# Altium project HV_Module_6W.PrjPCB (part 3 of 3)

## Sheet Supply_12V_ISOL.SchDoc: HV_Module
size 420 x 297 mm; EDA_Number: ARTIQ; Projet: HV_Module; Author: G.Kasprowicz; CompanyName: WUT ISE; DrawnBy: G.Kasprowicz; Organization: WUT ISE; Address1: PW ISE; Address2: Nowowiejska 15/19 00-665 Warsaw; Address3: gkasprow@gmail.com; DocumentNumber: 6; Revision: 1.0; SheetNumber: 6; SheetTotal: 6; ModifiedBy: -; CheckedDate: -; Title2: Supply_5V_ISOL; DivGrp: WUT ISE; Designer: G.Kasprowicz; ModifiedDate: -; ProjectName: Sensor Box
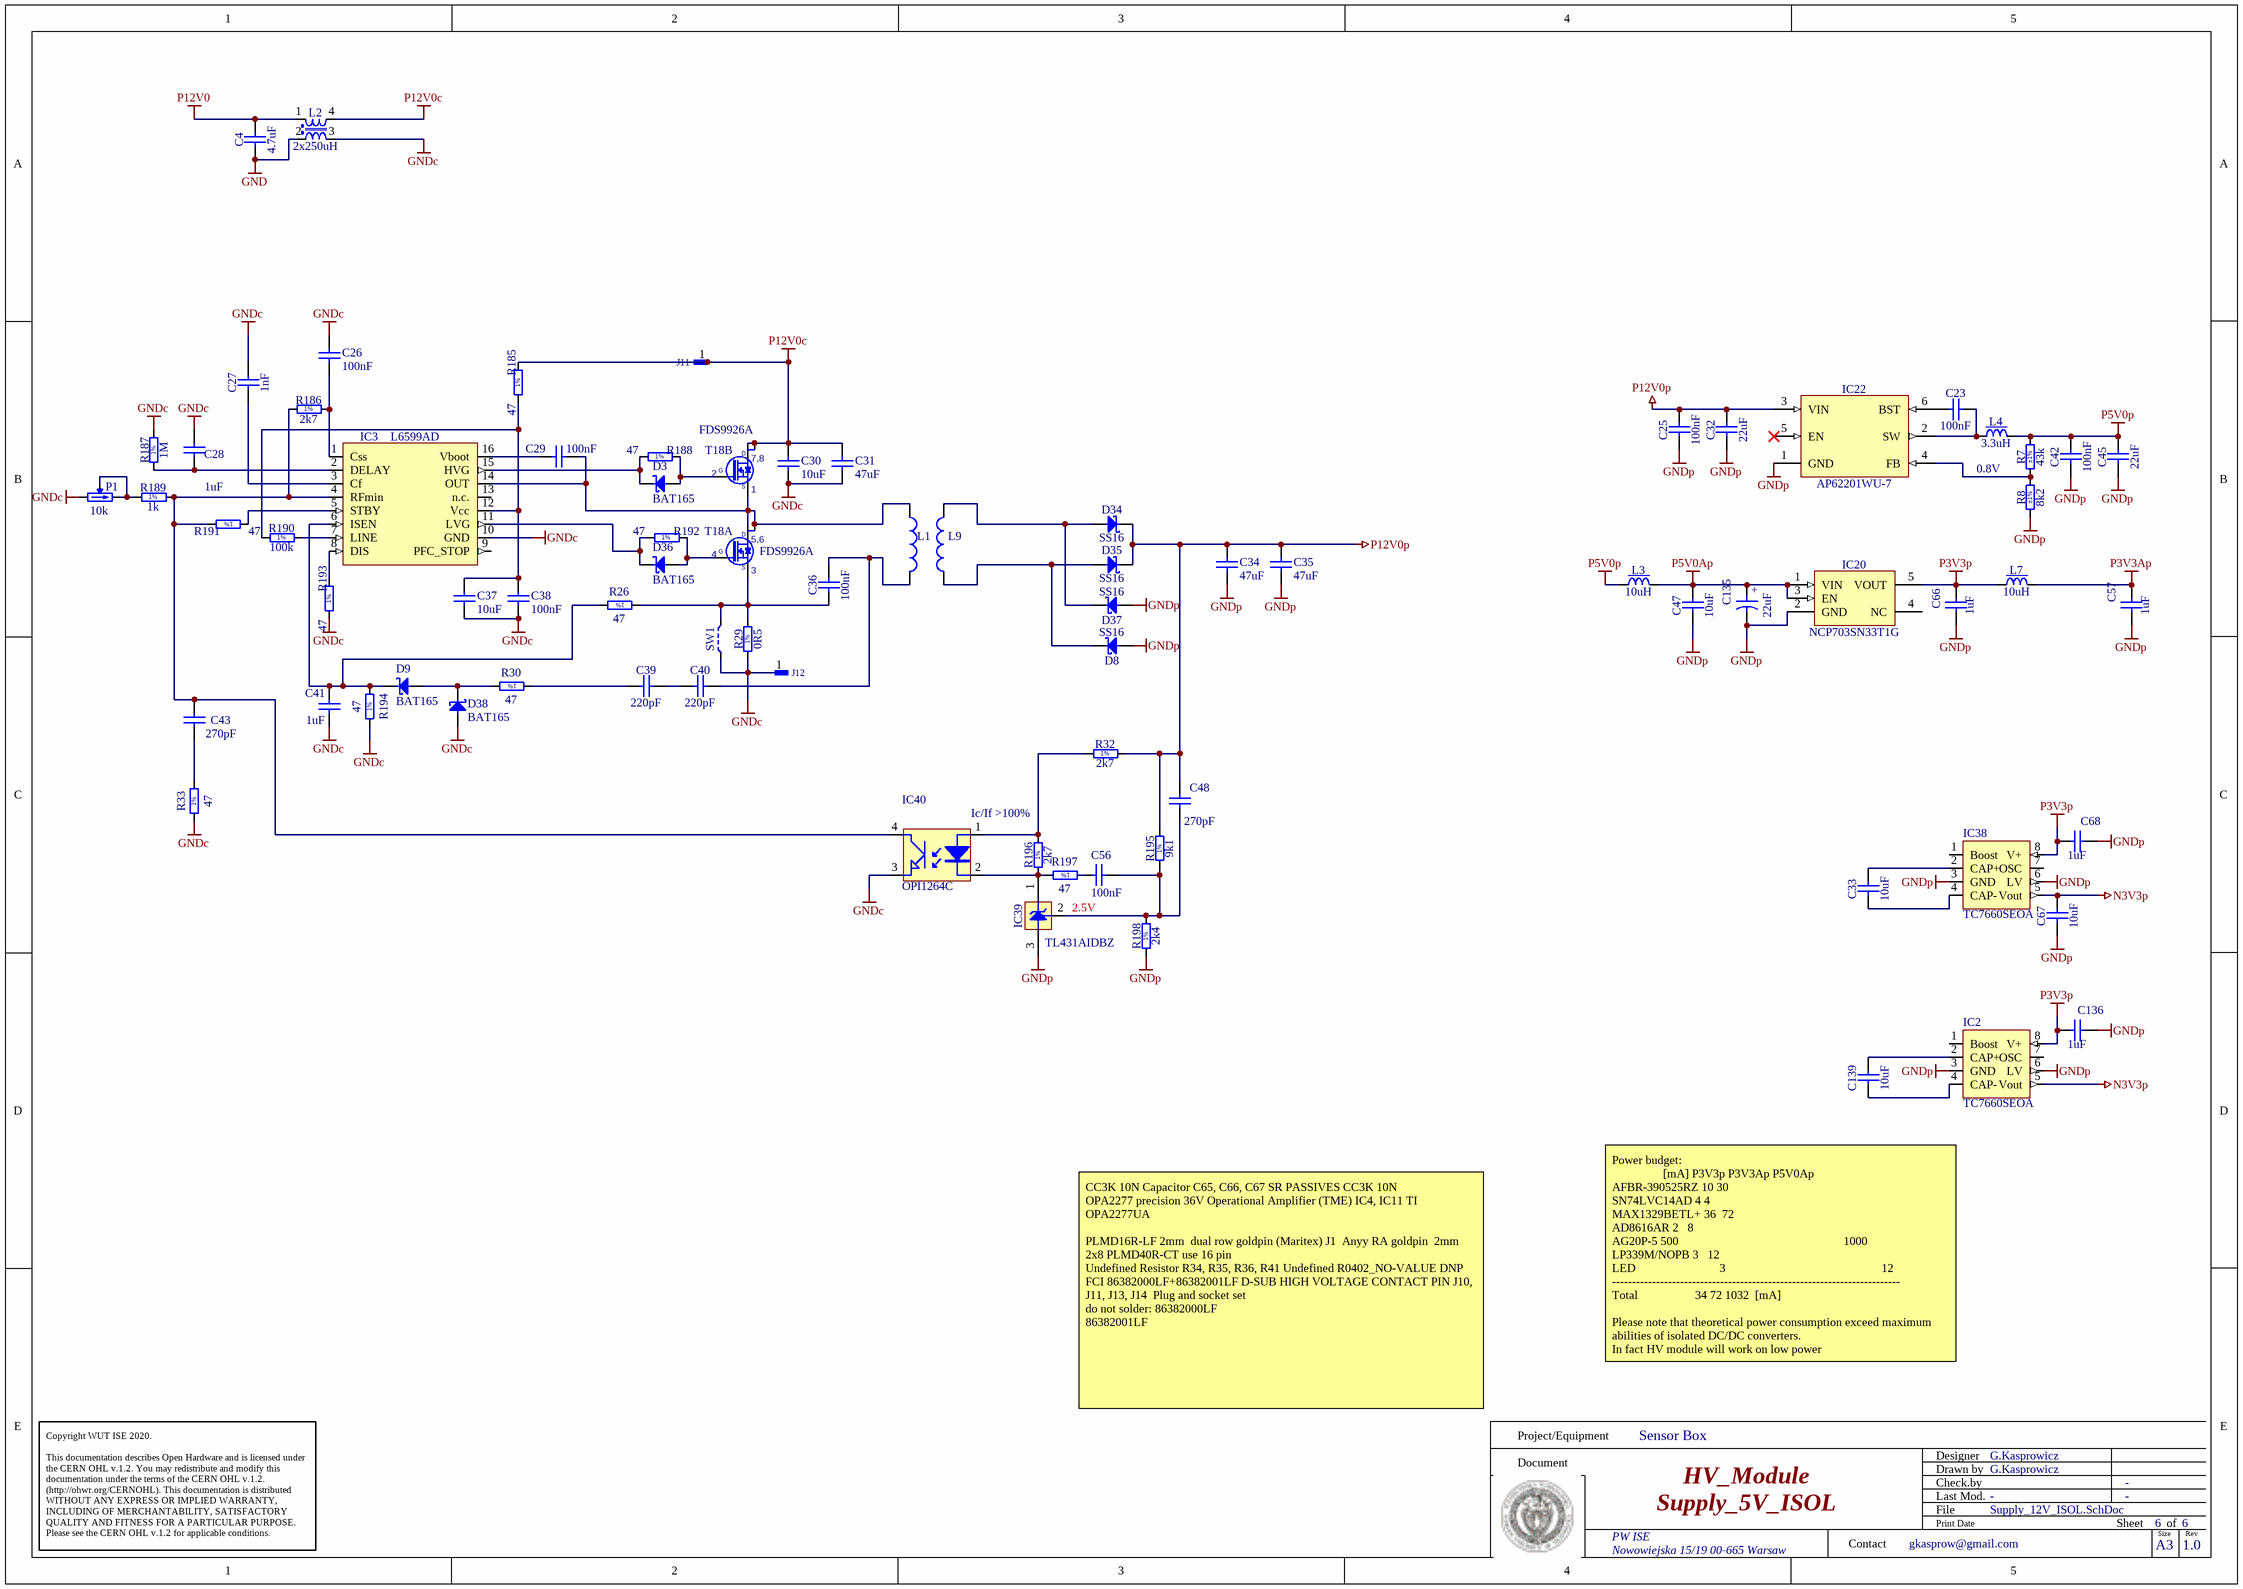
[diagram p4: Supply_12V_ISOL.SchDoc]

### Parts
C4  4.7uF  [CAPC2012X145N]
C23  100nF  [CAPC1005X55N]
C25  100nF  [CAPC1005X55N]
C26  100nF  [CAPC1005X55N]
C27  1nF  [CAPC1608X90N]
C28  1uF  [CAPC1608X87N]
C29  100nF  [CAPC1005X55N]
C30  10uF  [CAPC3216X180N]
C31  47uF  [CAPC3216X180N]
C32  22uF  [CAPC2012X135N]
C33  10uF  [CAPC1608X80N]
C34  47uF  [CAPC3216X180N]
C35  47uF  [CAPC3216X180N]
C36  100nF  [CAPC4532X250N]
C37  10uF  [CAPC3216X180N]
C38  100nF  [CAPC1005X55N]
C39  220pF  [CAPC3225X200N]
C40  220pF  [CAPC3225X200N]
C41  1uF  [CAPC1608X87N]
C42  100nF  [CAPC1005X55N]
C43  270pF  [CAPC1608X87N]
C45  22uF  [CAPC2012X135N]
C47  10uF  [CAPC1608X80N]
C48  270pF  [CAPC1608X87N]
C56  100nF  [CAPC1005X55N]
C57  1uF  [CAPC1005X55N]
C66  1uF  [CAPC1005X55N]
C67  10uF  [CAPC1608X80N]
C68  1uF  [CAPC1005X55N]
C135  22uF  [CAPMP3528X210N]
C136  1uF  [CAPC1005X55N]
C139  10uF  [CAPC1608X80N]
D3  BAT165  [SOD2512X110N]
D8  SS16  [DIOM5127X229N]
D9  BAT165  [SOD2512X110N]
D34  SS16  [DIOM5127X229N]
D35  SS16  [DIOM5127X229N]
D36  BAT165  [SOD2512X110N]
D37  SS16  [DIOM5127X229N]
D38  BAT165  [SOD2512X110N]
IC2  TC7660SEOA  [SO-8]
IC3  L6599AD  [SOIC127P600X175-16N]
IC20  NCP703SN33T1G  [SOT95P275X110-5N]
IC22  AP62201WU-7  [SOT95P280X100-6N]
IC38  TC7660SEOA  [SO-8]
IC39  TL431AIDBZ  [SOT95P237X112-3N]
IC40  OPI1264C  [OPI1264C]
J11  SMD Pad  [R400X300]  (value not drawn)  (no BOM)
J12  SMD Pad  [R400X300]  (value not drawn)  (no BOM)
L1  6.8uH  [760308101104]  (value not drawn)
L2  2x250uH  [IND_WURTH_WE-SL2]
L3  10uH  [IND_BOURNS_PM43]
L4  3.3uH  [IND_WURTH_WE-TPC_4828]
L7  10uH  [IND_BOURNS_PM43]
L9  6.8uH  [760308101104]  (value not drawn)
P1  10k  [TRIM_BOURNS_3314G-1]
R7  43k  Tolerance: ±1%  [RESC1005X40N]
R8  8k2  Tolerance: ±1%  [RESC1005X40N]
R26  47  [RESC1608X55N]
R29  0R5  [RESC6532X80N]
R30  47  [RESC1608X55N]
R32  2k7  [RESC1608X55N]
R33  47  [RESC1608X55N]
R185  47  [RESC1608X55N]
R186  2k7  [RESC1608X55N]
R187  1M  [RESC1608X55N]
R188  47  [RESC1608X55N]
R189  1k  [RESC1005X40N]
R190  100k  [RESC1005X40N]
R191  47  [RESC1608X55N]
R192  47  [RESC1608X55N]
R193  47  [RESC1608X55N]
R194  47  [RESC1608X55N]
R195  9k1  [RESC1608X55N]
R196  2k7  [RESC1608X55N]
R197  47  [RESC1608X55N]
R198  2k4  [RESC1608X55N]
SW1  Switch  [JUMPSMD0805_G50]  (value not drawn)  (no BOM)
T18  FDS9926A  [SOIC127P600X175-8N]  (parts A,B of 2)

### Nets
GND: C4.1 L2.2
GNDc: C26.1 C27.2 C28.2 C30.2 C31.2 C37.2 C38.2 C41.1 D38.2(A) IC3.10(GND) IC40.3(E) J12.1 L2.3 P1.1(CCW) R29.1 R33.1 R187.2 R193.1 R194.1 SW1.1
GNDp: C25.1 C32.1 C34.2 C35.2 C42.1 C45.1 C47.1 C57.1 C66.1 C67.1 C68.2 C135.2 C136.2 D8.2(A) D37.2(A) IC2.3(GND) IC2.6(LV) IC20.2(GND) IC22.1(GND) IC38.3(GND) IC38.6(LV) IC39.3(A) R8.1 R198.1
N3V3p: C67.2 IC2.5(Vout) IC38.5(Vout)
P3V3Ap: C57.2 L7.2
P3V3p: C66.2 C68.1 C136.1 IC2.8(V+) IC20.5(VOUT) IC38.8(V+) L7.1
P5V0Ap: C47.2 C135.1 IC20.1(VIN) IC20.3(EN) L3.2
P5V0p: C42.2 C45.2 L3.1 L4.2 R7.2
P12V0: C4.2 L2.1
P12V0c: C30.1 C31.1 J11.1 L2.4 R185.2 T18.7(D) T18.8(D)
P12V0p: C25.2 C32.2 C34.1 C35.1 C48.2 D34.1(C) D35.1(C) IC22.3(VIN) R32.2 R195.2
NetC23_1: C23.1 IC22.6(BST)
NetC23_2: C23.2 IC22.2(SW) L4.1
NetC26_2: C26.2 IC3.1(Css) R186.2
NetC27_1: C27.1 IC3.3(Cf)
NetC28_1: C28.1 IC3.2(DELAY) R187.1
NetC29_1: C29.1 IC3.16(Vboot)
NetC29_2: C29.2 IC3.14(OUT) L1.1 T18.1(S) T18.5(D) T18.6(D)
NetC33_1: C33.1 IC38.4(CAP-)
NetC33_2: C33.2 IC38.2(CAP+)
NetC36_1: C36.1 R26.1 R29.2 SW1.2 T18.3(S)
NetC36_2: C36.2 C40.2 L1.2
NetC37_1: C37.1 C38.1 IC3.12(Vcc) R185.1 R190.1
NetC39_1: C39.1 R30.1
NetC39_2: C39.2 C40.1
NetC41_2: C41.2 D9.1(C) IC3.6(ISEN) R26.2 R194.2
NetC43_1: C43.1 R33.2
NetC43_2: C43.2 IC3.4(RFmin) IC40.4(C) R186.1 R189.2 R191.2
NetC48_1: C48.1 C56.1 IC39.2(Adj) R195.1 R198.2
NetC56_2: C56.2 R197.1
NetC139_1: C139.1 IC2.4(CAP-)
NetC139_2: C139.2 IC2.2(CAP+)
NetD3_1: D3.1(C) IC3.15(HVG) R188.1
NetD3_2: D3.2(A) R188.2 T18.2(G)
NetD8_1: D8.1(C) D35.2(A) L9.1
NetD9_2: D9.2(A) D38.1(C) R30.2
NetD34_2: D34.2(A) D37.1(C) L9.2
NetD36_1: D36.1(C) IC3.11(LVG) R192.1
NetD36_2: D36.2(A) R192.2 T18.4(G)
NetIC3_5: IC3.5(STBY) R191.1
NetIC3_7: IC3.7(LINE) R190.2
NetIC3_8: IC3.8(DIS) R193.2
NetIC22_4: IC22.4(FB) R7.1 R8.2
NetIC39_1: IC39.1(C) IC40.2(K) R196.1 R197.2
NetIC40_1: IC40.1(A) R32.1 R196.2
NetP1_2: P1.2(W) P1.3(CW) R189.1

Not connected (* = marked no-connect by the designer): IC2 1(Boost) 7(OSC); IC3 9(PFC_STOP) 13(n.c.); IC20 4(NC); IC22 5(EN)*; IC38 1(Boost) 7(OSC)

### Notes on the sheet
- 0.8V
- 2.5V
- CC3K 10N	Capacitor	C65, C66, C67	SR PASSIVES	CC3K 10N
  OPA2277	precision 36V Operational Amplifier (TME)	IC4, IC11	TI	OPA2277UA
  PLMD16R-LF	2mm  dual row goldpin (Maritex)	J1		Anyy RA goldpin  2mm 2x8	PLMD40R-CT use 16 pin
  Undefined	Resistor	R34, R35, R36, R41	Undefined	R0402_NO-VALUE	DNP
  FCI 86382000LF+86382001LF	D-SUB HIGH VOLTAGE CONTACT PIN	J10, J11, J13, J14		Plug and socket set
  do not solder:	86382000LF
  86382001LF
- Power budget:
  [mA]	P3V3p	P3V3Ap	P5V0Ap
  AFBR-390525RZ	10	30
  SN74LVC14AD	4	4
  MAX1329BETL+	36		72
  AD8616AR	2			8
  AG20P-5	500	                		                                    1000
  LP339M/NOPB	3			12
  LED                            3                                                    12
  ------------------------------------------------------------------------
  Total		                 34	72	1032  [mA]
  Please note that theoretical power consumption exceed maximum abilities of isolated DC/DC converters.
  In fact HV module will work on low power
- Project/Equipment
- Document
- Designer
- Drawn by
- Check.by
- Copyright WUT ISE 2020.
  This documentation describes Open Hardware and is licensed under the CERN OHL v.1.2. You may redistribute and modify this documentation under the terms of the CERN OHL v.1.2. (http://ohwr.org/CERNOHL). This documentation is distributed WITHOUT ANY EXPRESS OR IMPLIED WARRANTY, INCLUDING OF MERCHANTABILITY, SATISFACTORY QUALITY AND FITNESS FOR A PARTICULAR PURPOSE. Please see the CERN OHL v.1.2 for applicable conditions.
- Contact
- File
- Last Mod.
- Print Date
- Sheet
- Size
- A3
- of
- Rev
- (in symbol CTE3528-21_22UF_20V_10%) +
- (in symbol FDS9926A, part A) 5,6
- (in symbol FDS9926A, part B) 7,8
- (in symbol OPTO-OPI1264C) Ic/If >100%
- (in symbol R0402_1K_1%_0.0625W_100PPM) 1%
- (in symbol R0402_100K_1%_0.0625W_100PPM) 1%
- (in symbol R0603_1M_1%_0.1W_100PPM) 1%
- (in symbol R0603_2K4_1%_0.1W_100PPM) 1%
- (in symbol R0603_2K7_1%_0.1W_100PPM) 1%
- (in symbol R0603_9K1_1%_0.1W_100PPM) 1%
- (in symbol R0603_47R_1%_0.1W_100PPM) 1%
- (in symbol R2512_0R5_1%_1.5W_100PPM) 1%

### Library data of the parts
C4 = CC0805_4.7UF_50V_10%_X7R: Non-polarised capacitor; Part Description: SMD Multilayer Chip Ceramic Capacitor; Manufacturer: GENERIC; Manufacturer1 Part Number: C2012X7R1H475K125; Voltage: 50V; TC: X7R; Tolerance: ±10%; Part Number: CC0805_4.7UF_50V_10%_X7R; Component Kind: Standard; Component Type: Standard; Pin Count: 2; Value: 4.7uF; Status: Preferred; Manufacturer Part Number: CC0805_4.7UF_50V_10%_X7R; Case: 0805; Mounted: Yes; Socket: No; SMD: Yes; Sense: No; Manufacturer1 Example: TDK; Manufacturer1 ComponentHeight: 1.45mm; HelpURL: \\cern.ch\dfs\Applications\Altium\Datasheets\CC0805_X7R_TDK_C.pdf; Author: CERN DEM JMW; CreateDate: 30.07.2021; LatestRevisionDate: 30.07.2021
C23 C25 C42 = CC0402_100NF_16V_10%_X5R: Non-polarised capacitor; Part Description: SMD Multilayer Chip Ceramic Capacitor; Manufacturer: GENERIC; Manufacturer1 Part Number: GRM155R61C104KA88D; Voltage: 16V; TC: X5R; Tolerance: ±10%; Part Number: CC0402_100NF_16V_10%_X5R; Component Kind: Standard; Component Type: Standard; Pin Count: 2; Value: 100nF; Status: None; Manufacturer Part Number: CC0402_100NF_16V_10%_X5R; Case: 0402; Mounted: Yes; Socket: No; SMD: Yes; Sense: No; Manufacturer1 Example: MURATA; Manufacturer1 ComponentHeight: 0.55mm; HelpURL: \\cern.ch\dfs\Applications\Altium\Datasheets\CC0402_X5R_MURATA_GRM.pdf; Author: CERN DEM JLC; CreateDate: 10.12.2013; LatestRevisionDate: 10.12.2013
C26 C29 C38 C56 = CC0402_100NF_16V_10%_X7R: Non-polarised capacitor; Part Description: SMD Multilayer Chip Ceramic Capacitor; Manufacturer: GENERIC; Manufacturer1 Part Number: GRM155R71C104KA88D; Voltage: 16V; TC: X7R; Tolerance: ±10%; Table: Capacitors SMD; Part Number: CC0402_100NF_16V_10%_X7R; Component Kind: Standard; Component Type: Standard; Pin Count: 2; Value: 100nF; Status: Not Recommended; Manufacturer Part Number: CC0402_100NF_16V_10%_X7R; Case: 0402; Mounted: Yes; Socket: No; SMD: Yes; Manufacturer1 Example: MURATA; Manufacturer1 ComponentHeight: 0.55mm; HelpURL: \\cern.ch\dfs\Applications\Altium\Datasheets\CC0402_X7R_MURATA_GRM.pdf; Author: CERN DEM JLC; CreateDate: 2013-12-05; LatestRevisionDate: 2007-12-03
C27 = CC0603_1NF_50V_5%_NP0: Non-polarised capacitor; Part Description: SMD Multilayer Chip Ceramic Capacitor; Manufacturer: GENERIC; Manufacturer1 Part Number: CC0603JRNPO9BN102; Voltage: 50V; TC: C0G/NP0; Tolerance: ±5%; Part Number: CC0603_1NF_50V_5%_NP0; Component Kind: Standard; Component Type: Standard; Pin Count: 2; Value: 1nF; Status: Preferred; Manufacturer Part Number: CC0603_1NF_50V_5%_NP0; Case: 0603; Mounted: Yes; Socket: No; SMD: Yes; Sense: No; Manufacturer1 Example: YAGEO PHYCOMP; Manufacturer1 ComponentHeight: 0.9mm; HelpURL: \\cern.ch\dfs\Applications\Altium\Datasheets\CC0805_NP0_PHYCOMP_16VTO50V.pdf; Author: CERN DEM JLC; CreateDate: 22.10.2012; LatestRevisionDate: 22.10.2012
C28 C41 = CC0603_1UF_25V_10%_X7R: Non-polarised capacitor; Part Description: SMD Multilayer Chip Ceramic Capacitor; Manufacturer: GENERIC; Manufacturer1 Part Number: GRM188R71E105KA12D; Voltage: 25V; TC: X7R; Tolerance: ±10%; Part Number: CC0603_1UF_25V_10%_X7R; Component Kind: Standard; Component Type: Standard; Pin Count: 2; Value: 1uF; Status: None; Manufacturer Part Number: CC0603_1UF_25V_10%_X7R; Case: 0603; Mounted: Yes; Socket: No; SMD: Yes; Sense: No; Manufacturer1 Example: MURATA; Manufacturer1 ComponentHeight: 0.9mm; HelpURL: \\cern.ch\dfs\Applications\Altium\Datasheets\CC0603_X7R_MURATA.pdf; Author: CERN DEM JLC; CreateDate: 2011-01-18; LatestRevisionDate: 2011-01-18
C30 C37 = CC1206_10UF_25V_10%_X7R: Non-polarised capacitor; Part Description: SMD Multilayer Chip Ceramic Capacitor; Manufacturer: GENERIC; Manufacturer1 Part Number: C1206C106K4RACTU; Voltage: 25V; TC: X7R; Tolerance: ±10%; Table: Capacitors SMD; Part Number: CC1206_10UF_25V_10%_X7R; Component Kind: Standard; Component Type: Standard; Pin Count: 2; Value: 10uF; Status: Preferred; Manufacturer Part Number: CC1206_10uF_25V_10%_X7R; Case: 1206; Mounted: Yes; Socket: No; SMD: Yes; Manufacturer1 Example: KEMET; Manufacturer1 ComponentHeight: 1.8mm; HelpURL: \\cern.ch\dfs\Applications\Altium\Datasheets\CC1206_X7R_KEMET.pdf; Author: CERN DEM JLC; CreateDate: 2012-09-12; LatestRevisionDate: 2012-09-12
C31 C34 C35 = CC1206_47UF_25V_20%_X5R: Non-polarised capacitor; Part Description: SMD Multilayer Chip Ceramic Capacitor; Manufacturer: TDK; Manufacturer Part Number: C3216X5R1E476M160AC; Voltage: 25V; TC: X5R; Tolerance: ±20%; Table: Capacitors SMD; Part Number: CC1206_47UF_25V_20%_X5R; Component Kind: Standard; Component Type: Standard; Pin Count: 2; Value: 47uF; Status: None; Case: 1206; Mounted: Yes; Socket: No; SMD: Yes; HelpURL: \\cern.ch\dfs\Applications\Altium\Datasheets\CC1206_X5R_TDK_C.pdf; Author: CERN DEM JLC; CreateDate: 2013-11-20; LatestRevisionDate: 2013-11-20; ComponentHeight: 1.8mm
C32 C45 = CC0805_22UF_16V_10%_X5R: Non-polarised capacitor; Part Description: SMD Multilayer Chip Ceramic Capacitor; Manufacturer: GENERIC; Manufacturer1 Part Number: C2012X5R1C226KT; Voltage: 16V; TC: X5R; Tolerance: ±10%; Part Number: CC0805_22UF_16V_10%_X5R; Component Kind: Standard; Component Type: Standard; Pin Count: 2; Value: 22uF; Status: Preferred; Manufacturer Part Number: CC0805_22UF_16V_10%_X5R; Case: 0805; Mounted: Yes; Socket: No; SMD: Yes; Sense: No; Manufacturer1 Example: TDK; Manufacturer1 ComponentHeight: 1.35mm; HelpURL: \\cern.ch\dfs\Applications\Altium\Datasheets\CC0805_X5R_TDK_C.pdf; Author: CERN DEM JLC; CreateDate: 25.10.2012; LatestRevisionDate: 25.10.2012
C33 C47 C67 C139 = CC0603_10UF_16V_20%_X5R: Non-polarised capacitor; Part Description: SMD Multilayer Chip Ceramic Capacitor; Manufacturer: GENERIC; Manufacturer1 Part Number: GRM188R61C106MA73D; Voltage: 16V; TC: X5R; Tolerance: ±20%; Part Number: CC0603_10UF_16V_20%_X5R; Component Kind: Standard; Component Type: Standard; Pin Count: 2; Value: 10uF; Status: None; Manufacturer Part Number: CC0603_10UF_16V_20%_X5R; Case: 0603; Mounted: Yes; Socket: No; SMD: Yes; Sense: No; Manufacturer1 Example: MURATA; Manufacturer1 ComponentHeight: 0.8mm; HelpURL: \\cern.ch\dfs\Applications\Altium\Datasheets\CC0603_X5R_MURATA_GRM.pdf; Author: CERN DEM MR; CreateDate: 02.03.2016; LatestRevisionDate: 02.03.2016
C36 = CC1812_100NF_500V_10%_X7R: Non-polarised capacitor; Part Description: SMD Multilayer Chip Ceramic Capacitor; Manufacturer: GENERIC; Manufacturer1 Part Number: 1812Y5000104KXB; Voltage: 500V; TC: X7R; Tolerance: ±10%; Part Number: CC1812_100NF_500V_10%_X7R; Component Kind: Standard; Component Type: Standard; Pin Count: 2; Value: 100nF; Status: None; Manufacturer Part Number: CC1812_100NF_500V_10%_X7R; Case: 1812; Mounted: Yes; Socket: No; SMD: Yes; Sense: No; Manufacturer1 Example: SYFER; Manufacturer1 ComponentHeight: 2.5mm; HelpURL: \\cern.ch\dfs\Applications\Altium\Datasheets\CC1812_X7R_SYFER.pdf; Author: CERN DEM JMW; CreateDate: 2009-01-23; LatestRevisionDate: 2011-06-07
C39 C40 = CMIC1210_220PF_100V_0.5PF_CORNELL_MC12FA221D-F: Non-polarised capacitor; Part Description: SMD RF Multilayer Mica Capacitor (Type MC); Manufacturer: CORNELL DUBILIER; Voltage: 100V; Tolerance: ±0.5pF; Part Number: CMIC1210_220PF_100V_0.5PF_CORNELL_MC12FA221D-F; Component Kind: Standard; Component Type: Standard; Pin Count: 2; Value: 220pF; Status: Not Recommended; Manufacturer Part Number: MC12FA221D-F; Case: 1210; Mounted: Yes; Socket: No; SMD: Yes; Sense: No; ComponentHeight: 2mm; HelpURL: \\cern.ch\dfs\Applications\Altium\Datasheets\CMIC1210_CORNELL_MC.pdf; Author: CERN DEM JLC; CreateDate: 2011-08-10; LatestRevisionDate: 2011-08-10
C43 C48 = CC0603_270PF_50V_5%_NP0: Non-polarised capacitor; Part Description: SMD Multilayer Chip Ceramic Capacitor; Manufacturer: GENERIC; Manufacturer1 Part Number: 223886715271; Voltage: 50V; TC: C0G/NP0; Tolerance: ±5%; Part Number: CC0603_270PF_50V_5%_NP0; Component Kind: Standard; Component Type: Standard; Pin Count: 2; Value: 270pF; Status: Preferred; Manufacturer Part Number: CC0603_270PF_50V_5%_NP0; Case: 0603; Mounted: Yes; Socket: No; SMD: Yes; Sense: No; Manufacturer1 Example: PHYCOMP; Manufacturer1 ComponentHeight: 0.87mm; HelpURL: \\cern.ch\dfs\Applications\Altium\Datasheets\CC0603_NP0_PHYCOMP.pdf; Author: CERN DEM JLC; CreateDate: 2007-12-03; LatestRevisionDate: 2007-12-03
C57 C66 C68 C136 = CC0402_1UF_16V_10%_X5R: as C1 on sheet Isolators_HV_6W; Part Number: CC0402_1UF_16V_10%_X5R; Component Kind: Standard; Component Type: Standard; Pin Count: 2; Value: 1uF; Status: Preferred; Manufacturer Part Number: CC0402_1UF_16V_10%_X5R; Case: 0402; Mounted: Yes; Socket: No; SMD: Yes; Sense: No; Manufacturer1 Example: TDK; Manufacturer1 ComponentHeight: 0.55mm; HelpURL: \\cern.ch\dfs\Applications\Altium\Datasheets\CC0402_X5R_TDK_C.pdf; Author: CERN DEM JLC; CreateDate: 2012-10-25; LatestRevisionDate: 2012-10-25
C135 = CTE3528-21_22UF_20V_10%: Polarised capacitor; Part Description: Solid Tantalum Chip Capacitor; Manufacturer: GENERIC; Manufacturer1 Part Number: TAJB226K020R; Voltage: 20V; Tolerance: ±10%; Part Number: CTE3528-21_22UF_20V_10%; Component Kind: Standard; Component Type: Standard; Pin Count: 2; Value: 22uF; Status: Preferred; Manufacturer Part Number: CTE3528-21_22UF_20V_10%; Case: B; Mounted: Yes; Socket: No; SMD: Yes; Sense: No; Manufacturer1 Example: AVX; Manufacturer1 ComponentHeight: 2.1mm; HelpURL: \\cern.ch\dfs\Applications\Altium\Datasheets\CTE_AVX_TAJ.pdf; Author: CERN DEM JLC; CreateDate: 03/12/2007; LatestRevisionDate: 03/12/2007
D3 D9 D36 D38 = BAT165: Schottky Diode; Part Description: Medium Power AF Schottky Diode; Manufacturer: INFINEON; Voltage: 40V; Power: 750mA; Mounted: No; PressFit: No; Bonding: No; Table: Diodes; Part Number: BAT165; Component Kind: Standard; Component Type: Standard; Device: BAT165; PackageDescription: Small Outline Diode Flat Lead (SOD-323), 1.70mm W X 1.25mm L X 1.10mm H body,  IPC Medium Density; Manufacturer Part Number: BAT165; Pin Count: 2; Case: SOD323; Socket: No; SMD: Yes; ComponentHeight: 1.1mm; HelpURL: \\cern.ch\dfs\Applications\Altium\Datasheets\BAT165.pdf; Author: CERN DEM JLC; CreateDate: 2014-11-12; LatestRevisionDate: 2014-11-12
D8 D34 D35 D37 = SS16: Schottky Diode; Part Description: Surface Mount Schottky Barrier Rectifier; Manufacturer: VISHAY GENERAL SEMICONDUCTOR; Voltage: 60V; Power: 1A; PressFit: No; Bonding: No; Part Number: SS16; Component Kind: Standard; Component Type: Standard; Device: SS16; PackageDescription: DO-214-AC Molded Diode, Body 5.1x2.7mm, IPC Medium Density; Manufacturer Part Number: SS16; Pin Count: 2; Case: DO-214AC; Mounted: Yes; Socket: No; SMD: Yes; Sense: No; ComponentHeight: 2.29mm; HelpURL: \\cern.ch\dfs\Applications\Altium\Datasheets\SS16.pdf; Author: CERN DEM JLC; CreateDate: 2008-07-15; LatestRevisionDate: 2010-08-23
IC2 IC38 = PM_TC7660: 20mA PUMP DC-TO-DC VOLTAGE CONVERTER
IC3 = PM_L6599: Improved high voltage resonant LLC controller; Part Description: Improved high voltage resonant controller; Manufacturer: ST MICROELECTRONICS; PressFit: No; Bonding: No; Part Number: L6599AD; Component Kind: Standard; Component Type: Standard; Device: L6599AD; PackageDescription: SOIC 16, Pitch 1.27mm - Body 4x10mm, IPC Medium Density; Manufacturer Part Number: L6599AD; Pin Count: 16; Case: SO-16; Mounted: Yes; Socket: No; SMD: Yes; Sense: No; ComponentHeight: 1.75mm; Author: GK; CreateDate: 2016-05-23; LatestRevisionDate: 2016-05-23
IC20 = NCP703SN33T1G: 3.3V 300mA, Ultra-Low Quiescent Current, IQ 12uA, Ultra-Low Noise, LDO Voltage Regulator; Manufacturer: ON SEMICONDUCTOR; PressFit: No; Bonding: No; Part Number: NCP703SN33T1G; Component Kind: Standard; Component Type: Standard; Device: NCP703SN33T1G; PackageDescription: SOT, 0.95mm Pitch; 5 Pin, 1.50mm W X 3.00mm L X 1.10mm H Body, IPC Medium Density; Part Description: 3.3V 300mA, Ultra-Low Quiescent Current, IQ 12uA, Ultra-Low Noise, LDO Voltage Regulator; Manufacturer Part Number: NCP703SN33T1G; Pin Count: 5; Case: SOT23-5; Mounted: Yes; Socket: No; SMD: Yes; Sense: No; ComponentHeight: 1.1mm; HelpURL: \\cern.ch\dfs\Applications\Altium\Datasheets\NCP703SN33T1G.pdf; Author: CERN DEM JLC; CreateDate: 16.02.2017; LatestRevisionDate: 16.02.2017
IC22 = AP62201WU-7: 4.2V TO 18V INPUT, 2A LOW IQ SYNCHRONOUS BUCK CONVERTER; Manufacturer: DIODES INCORPORATED; PressFit: No; Bonding: No; Part Number: AP62201WU-7; Component Kind: Standard; Component Type: Standard; Device: AP62201WU-7; PackageDescription: SOT23, 0.95mm Pitch; 6 Pin, 1.625mm W X 2.90mm L X 1.00mm H body, IPC Medium Density; Part Description: 4.2V TO 18V INPUT, 2A LOW IQ SYNCHRONOUS BUCK CONVERTER; Manufacturer Part Number: AP62201WU-7; Pin Count: 6; Case: SOT23-6; Mounted: Yes; Socket: No; SMD: Yes; Sense: No; ComponentHeight: 1.1mm; HelpURL: \\cern.ch\dfs\Applications\Altium\Datasheets\AP6220x.pdf; Author: CERN DEM HF; CreateDate: 07.01.2022; LatestRevisionDate: 07.01.2022
IC39 = TL431AIDBZ: Precision Reference 1=Cathode 2=Adj 3=Anode; Part Description: Vref (2.495V) To 36V 1% Precision Programmable Reference; Manufacturer: TEXAS INSTRUMENTS; PressFit: No; Bonding: No; Part Number: TL431AIDBZ; Component Kind: Standard; Component Type: Standard; Device: TL431AIDBZ; PackageDescription: SOT, 0.95mm, Pitch; 3 Pin,1.30mm W X 2.92mm L X 1.12mm H Body, IPC Medium Density; Manufacturer Part Number: TL431AIDBZ; Pin Count: 3; Case: SOT-23; Mounted: Yes; Socket: No; SMD: Yes; Sense: No; ComponentHeight: 1.12mm; HelpURL: \\cern.ch\dfs\Applications\Altium\Datasheets\TL431AIDBZ.pdf; Author: CERN DEM JMW; CreateDate: 2015-10-22; LatestRevisionDate: 2015-10-22
IC40 = OPTO-OPI1264C: 10kV opto-coupler; Supplier 1: Newark; Supplier Part Number 1: 08F2863
J11 J12 = SMD_PAD_4X3MM: Single SMD Pad; Part Description: 4mm x 3mm SMD Pad; Mounted: No; Part Number: SMD_PAD_4X3MM; Component Type: Standard (No BOM); Pin Count: 1; Family: SMD Pad; Socket: No; SMD: No; Sense: No; Status: None; ComponentHeight: 0mm; HelpURL: Undefined; Author: CERN DEM JLC; CreateDate: 2010-03-15; LatestRevisionDate: 2010-03-15; PackageDescription: 4mm x  3mm SMD Pad
L1 L9 = 760308101104: WE-WPCC Wireless Power Transfer Transmitter Coil, THT, works with Qi Tx IC's, 6.8uH, 50W; Manufacturer: Wurth Elektronik; DC Resistance Max: 130mOhm; Q Factor: 42; Rated Current: 2.5A; Self Resonant Frequency: 20MHz; Manufacturer Part Number: 760308101104; Category: Wireless Power Transmission; Match Code: WE-WPCC; ComponentLink1Description: Website Link; ComponentLink1URL: https://www.we-online.com/redexpert/article/760308101104?ad; ComponentLink2Description: Datasheet Link; ComponentLink2URL: https://www.we-online.com/redexpert/spec/760308101104?ad; Mount: Through Hole; Operating Temperature Max: 105°C; Operating Temperature Min: -20°C; Packaging: Tray; Height: 2.8mm; Diameter: 20mm; Compliance: works with Qi Tx IC's; Inductance: 6.8uH; Power Capability: 50W
L2 = IND_250UH_50%_WURTH_WE-SL2-744224: Inductor Common Mode; Part Description: Common Mode SMD Line Filter (WE-SL2 Series); Manufacturer: WURTH ELEKTRONIK; Manufacturer Part Number: 744224; Power: 1.2A; Resistance: 0.13R; Tolerance: ±50%; Part Number: IND_250UH_50%_WURTH_WE-SL2-744224; Component Kind: Standard; Component Type: Standard; Pin Count: 4; Value: 2x250uH; Mounted: Yes; Socket: No; SMD: Yes; Sense: No; ComponentHeight: 5.3mm; HelpURL: \\cern.ch\dfs\Applications\Altium\Datasheets\IND_WURTH_WE-SL2_744224.pdf; Author: CERN DEM JLC; CreateDate: 02.12.2009; LatestRevisionDate: 15.10.2012
L3 L7 = IND_10UH_20%_BOURNS_PM43: Inductor With Core; Part Description: SMD Power Inductor; Manufacturer: BOURNS; Manufacturer Part Number: PM43-100M-RC; Power: 1.15A; Resistance: 0.18R; Tolerance: ±20%; Part Number: IND_10UH_20%_BOURNS_PM43; Component Kind: Standard; Component Type: Standard; Pin Count: 2; Value: 10uH; Status: None; Mounted: Yes; Socket: No; SMD: Yes; Sense: No; ComponentHeight: 3.5mm; HelpURL: \\cern.ch\dfs\Applications\Altium\Datasheets\IND_BOURNS_PM43.pdf; Author: CERN DEM JLC; CreateDate: 17/05/2011; LatestRevisionDate: 17/05/2011
L4 = IND_3.3UH_30%_WURTH_WE-TPC_744043003: Inductor With Core; Part Description: Shielded Tiny Power Inductor (WE-TPC Serie); Manufacturer: WURTH ELEKTRONIK; Power: 2.15A; Resistance: 0.03R; Tolerance: ±30%; Part Number: IND_3.3UH_30%_WURTH_WE-TPC_744043003; Component Kind: Standard; Component Type: Standard; Pin Count: 2; Value: 3.3uH; Manufacturer Part Number: 744043003; Mounted: Yes; Socket: No; SMD: Yes; Sense: No; ComponentHeight: 3mm; HelpURL: \\cern.ch\dfs\Applications\Altium\Datasheets\IND_WURTH_WE-TPC_744043003.pdf; Author: CERN DEM JLC; CreateDate: 12.07.2011; LatestRevisionDate: 24.01.2012
P1 = TRIM_1T_10K_BOURNS_3314G-1-103E: Trimming Potentiometer; Part Description: Single Turn 4mm Square Trimpot® Trimming Potentiometer (Top Adjust); Manufacturer: BOURNS; Power: 0.25W; TC: ±100ppm/°C; Tolerance: ±20%; Part Number: TRIM_1T_10K_BOURNS_3314G-1-103E; Component Kind: Standard; Component Type: Standard; Pin Count: 3; Value: 10k; Manufacturer Part Number: 3314G-1-103E; Case: 3314G-1; Mounted: Yes; Socket: No; SMD: Yes; Sense: No; ComponentHeight: 2.55mm; HelpURL: \\cern.ch\dfs\Applications\Altium\Datasheets\TRIM_BOURNS_3314G-1.pdf; Author: CERN DEM JLC; CreateDate: 2014-03-04; LatestRevisionDate: 2014-03-04
R7 = R0402_43K_1%_0.0625W_100PPM: Resistor - 1%; Part Description: General Purpose Thick Film Chip Resistor; Manufacturer: GENERIC; Manufacturer1 Part Number: 232270674303L; TC: ±100ppm/°C; PressFit: No; Part Number: R0402_43K_1%_0.0625W_100PPM; Component Kind: Standard; Component Type: Standard; Pin Count: 2; Value: 43k; Status: Not Recommended; Power: 0.0625W; Manufacturer Part Number: R0402_43K_1%_0.0625W_100PPM; Case: 0402; Mounted: Yes; Sense: No; Socket: No; SMD: Yes; Manufacturer1 Example: YAGEO PHYCOMP; Manufacturer1 ComponentHeight: 0.4mm; HelpURL: \\cern.ch\dfs\Applications\Altium\Datasheets\R0402_Phycomp_RC0402.pdf; Author: CERN DEM JLC; CreateDate: 03.12.2007; LatestRevisionDate: 17.10.2012
R8 = R0402_8K2_1%_0.0625W_100PPM: Resistor - 1%; Part Description: General Purpose Thick Film Chip Resistor; Manufacturer: GENERIC; Manufacturer1 Part Number: 232270678202L; TC: ±100ppm/°C; PressFit: No; Part Number: R0402_8K2_1%_0.0625W_100PPM; Component Kind: Standard; Component Type: Standard; Pin Count: 2; Value: 8k2; Status: Not Recommended; Power: 0.0625W; Manufacturer Part Number: R0402_8K2_1%_0.0625W_100PPM; Case: 0402; Mounted: Yes; Sense: No; Socket: No; SMD: Yes; Manufacturer1 Example: YAGEO PHYCOMP; Manufacturer1 ComponentHeight: 0.4mm; HelpURL: \\cern.ch\dfs\Applications\Altium\Datasheets\R0402_Phycomp_RC0402.pdf; Author: CERN DEM JLC; CreateDate: 03.12.2007; LatestRevisionDate: 17.10.2012
R26 R30 R33 R185 R188 R191-R194 R197 = R0603_47R_1%_0.1W_100PPM: Resistor - 1%; Part Description: General Purpose Thick Film Chip Resistor; Manufacturer: GENERIC; Manufacturer1 Part Number: NRC06F47R0TRF; Power: 0.1W; TC: ±100ppm/°C; Part Number: R0603_47R_1%_0.1W_100PPM; Component Kind: Standard; Component Type: Standard; Pin Count: 2; Value: 47; Status: Preferred; Tolerance: ±1%; Manufacturer Part Number: R0603_47R_1%_0.1W_100PPM; Case: 0603; Mounted: Yes; Sense: No; Socket: No; SMD: Yes; Manufacturer1 Example: NIC COMPONENT; Manufacturer1 ComponentHeight: 0.55mm; HelpURL: \\cern.ch\dfs\Applications\Altium\Datasheets\R0603_NIC_NRC.pdf; Author: CERN DEM JLC; CreateDate: 2007-12-03; LatestRevisionDate: 2008-03-13
R29 = R2512_0R5_1%_1.5W_100PPM: Resistor - 1%; Part Description: Thick Film Chip Resistor; Manufacturer: GENERIC; Manufacturer1 Part Number: LR2512-R50FW; Power: 1.5W; TC: ±100ppm/°C; Part Number: R2512_0R5_1%_1.5W_100PPM; Component Kind: Standard; Component Type: Standard; Pin Count: 2; Value: 0R5; Status: None; Tolerance: ±1%; Manufacturer Part Number: R2512_0R5_1%_1.5W_100PPM; Case: 2512; Mounted: Yes; Sense: No; Socket: No; SMD: Yes; Manufacturer1 Example: WELWYN; Manufacturer1 ComponentHeight: 0.8mm; HelpURL: \\cern.ch\dfs\Applications\Altium\Datasheets\R2512_WELWYN_LR.pdf; Author: CERN DEM JLC; CreateDate: 2010-08-23; LatestRevisionDate: 2010-08-23
R32 R186 R196 = R0603_2K7_1%_0.1W_100PPM: Resistor - 1%; Part Description: General Purpose Thick Film Chip Resistor; Manufacturer: GENERIC; Manufacturer1 Part Number: RC0603FR-072K7L; Power: 0.1W; TC: ±100ppm/°C; Part Number: R0603_2K7_1%_0.1W_100PPM; Component Kind: Standard; Component Type: Standard; Pin Count: 2; Value: 2k7; Status: Preferred; Tolerance: ±1%; Manufacturer Part Number: R0603_2K7_1%_0.1W_100PPM; Case: 0603; Mounted: Yes; Sense: No; Socket: No; SMD: Yes; Manufacturer1 Example: YAGEO PHYCOMP; Manufacturer1 ComponentHeight: 0.55mm; HelpURL: \\cern.ch\dfs\Applications\Altium\Datasheets\R0603_PHYCOMP_RC0603.pdf; Author: CERN DEM JLC; CreateDate: 2011-05-02; LatestRevisionDate: 2011-05-02
R187 = R0603_1M_1%_0.1W_100PPM: Resistor - 1%; Part Description: General Purpose Thick Film Chip Resistor; Manufacturer: GENERIC; Manufacturer1 Part Number: NRC06F1004TRF; Power: 0.1W; TC: ±100ppm/°C; Part Number: R0603_1M_1%_0.1W_100PPM; Component Kind: Standard; Component Type: Standard; Pin Count: 2; Value: 1M; Status: Preferred; Tolerance: ±1%; Manufacturer Part Number: R0603_1M_1%_0.1W_100PPM; Case: 0603; Mounted: Yes; Sense: No; Socket: No; SMD: Yes; Manufacturer1 Example: NIC COMPONENT; Manufacturer1 ComponentHeight: 0.55mm; HelpURL: \\cern.ch\dfs\Applications\Altium\Datasheets\R0603_NIC_NRC.pdf; Author: CERN DEM JLC; CreateDate: 2007-12-03; LatestRevisionDate: 2008-03-13
R189 = R0402_1K_1%_0.0625W_100PPM: as R78 on sheet HV_PWR_STAGE_6W; Part Number: R0402_1K_1%_0.0625W_100PPM; Component Kind: Standard; Component Type: Standard; Pin Count: 2; Value: 1k; Status: Not recommended; Power: 0.0625W; Tolerance: ±1%; Manufacturer Part Number: R0402_1K_1%_0.0625W_100PPM; Case: 0402; Mounted: Yes; Sense: No; Socket: No; SMD: Yes; Manufacturer1 Example: YAGEO PHYCOMP; Manufacturer1 ComponentHeight: 0.4mm; HelpURL: \\cern.ch\dfs\Applications\Altium\Datasheets\R0402_Phycomp_RC0402.pdf; Author: CERN DEM JLC; CreateDate: 2007-12-03; LatestRevisionDate: 2012-10-17
R190 = R0402_100K_1%_0.0625W_100PPM: Resistor - 1%; Part Description: General Purpose Thick Film Chip Resistor; Manufacturer: GENERIC; Manufacturer1 Part Number: 232270671004L; TC: ±100ppm/°C; Part Number: R0402_100K_1%_0.0625W_100PPM; Component Kind: Standard; Component Type: Standard; Pin Count: 2; Value: 100k; Status: Not recommended; Power: 0.0625W; Tolerance: ±1%; Manufacturer Part Number: R0402_100K_1%_0.0625W_100PPM; Case: 0402; Mounted: Yes; Sense: No; Socket: No; SMD: Yes; Manufacturer1 Example: YAGEO PHYCOMP; Manufacturer1 ComponentHeight: 0.4mm; HelpURL: \\cern.ch\dfs\Applications\Altium\Datasheets\R0402_Phycomp_RC0402.pdf; Author: CERN DEM JLC; CreateDate: 2007-12-03; LatestRevisionDate: 2012-10-17
R195 = R0603_9K1_1%_0.1W_100PPM: Resistor - 1%; Part Description: General Purpose Thick Film Chip Resistor; Manufacturer: GENERIC; Manufacturer1 Part Number: NRC06F9101TRF; Power: 0.1W; TC: ±100ppm/°C; Part Number: R0603_9K1_1%_0.1W_100PPM; Component Kind: Standard; Component Type: Standard; Pin Count: 2; Value: 9k1; Status: Preferred; Tolerance: ±1%; Manufacturer Part Number: R0603_9K1_1%_0.1W_100PPM; Case: 0603; Mounted: Yes; Sense: No; Socket: No; SMD: Yes; Manufacturer1 Example: NIC COMPONENT; Manufacturer1 ComponentHeight: 0.55mm; HelpURL: \\cern.ch\dfs\Applications\Altium\Datasheets\R0603_NIC_NRC.pdf; Author: CERN DEM JLC; CreateDate: 2007-12-03; LatestRevisionDate: 2008-03-13
R198 = R0603_2K4_1%_0.1W_100PPM: Resistor - 1%; Part Description: General Purpose Thick Film Chip Resistor; Manufacturer: GENERIC; Manufacturer1 Part Number: NRC06F2401TRF; Power: 0.1W; TC: ±100ppm/°C; Part Number: R0603_2K4_1%_0.1W_100PPM; Component Kind: Standard; Component Type: Standard; Pin Count: 2; Value: 2k4; Status: Preferred; Tolerance: ±1%; Manufacturer Part Number: R0603_2K4_1%_0.1W_100PPM; Case: 0603; Mounted: Yes; Sense: No; Socket: No; SMD: Yes; Manufacturer1 Example: NIC COMPONENT; Manufacturer1 ComponentHeight: 0.55mm; HelpURL: \\cern.ch\dfs\Applications\Altium\Datasheets\R0603_NIC_NRC.pdf; Author: CERN DEM JLC; CreateDate: 2007-12-03; LatestRevisionDate: 2008-03-13
SW1 = JUMPSMD0805_G50: 2 SMD Pads for Bound by Solder  Drop; Part Description: 2 SMD Pads for Bound by Solder Drop - Equivalent Size 0805 - Gap 0.5mm; Manufacturer: None; Mounted: No; PressFit: No; Part Number: JUMPSMD0805_G50; Component Type: Standard (No BOM); Pin Count: 2; PackageDescription: 2 SMD Pads for Bound by Solder Drop - Equivalent Size 0805 - Gap 0.5mm; Family: Switch; Socket: No; SMD: Yes; Sense: No; Status: None; Manufacturer Part Number: None; ComponentHeight: 0mm; HelpURL: None; Author: CERN DEM JLC; CreateDate: 2009-08-26; LatestRevisionDate: 2009-09-09
T18 = FDS9926A: 20V DUAL N-Channel 2.5V Specified PowerTrench MOSFET; Part Description: 20V DUAL N-Channel 2.5V Specified PowerTrench® MOSFET; Manufacturer: FAIRCHILD SEMICONDUCTOR; PressFit: No; Bonding: No; Part Number: FDS9926A; Component Kind: Standard; Component Type: Standard; Device: FDS9926A; PackageDescription: SOIC 8, Pitch 1.27mm - Body 4x5mm, IPC Medium Density; Manufacturer Part Number: FDS9926A; Pin Count: 8; Case: SOIC8; Mounted: Yes; Socket: No; SMD: Yes; Sense: No; ComponentHeight: 1.75mm; HelpURL: \\cern.ch\dfs\Applications\Altium\Datasheets\FDS9926A.pdf; Author: CERN DEM BC; CreateDate: 2015-09-02; LatestRevisionDate: 2015-09-02

## Sheet LED_indicators_6W.SchDoc: HV_Module
size 420 x 297 mm; EDA_Number: ARTIQ; Projet: HV_Module; Author: G.Kasprowicz; CompanyName: WUT ISE; DrawnBy: G.Kasprowicz; Organization: WUT ISE; Address1: PW ISE; Address2: Nowowiejska 15/19 00-665 Warsaw; Address3: gkasprow@gmail.com; DocumentNumber: 5; Revision: 1.0; SheetNumber: 5; SheetTotal: 6; ModifiedBy: -; CheckedDate: -; Title2: LED_Indicators; DivGrp: WUT ISE; Designer: G.Kasprowicz; ModifiedDate: -; ProjectName: Sensor Box
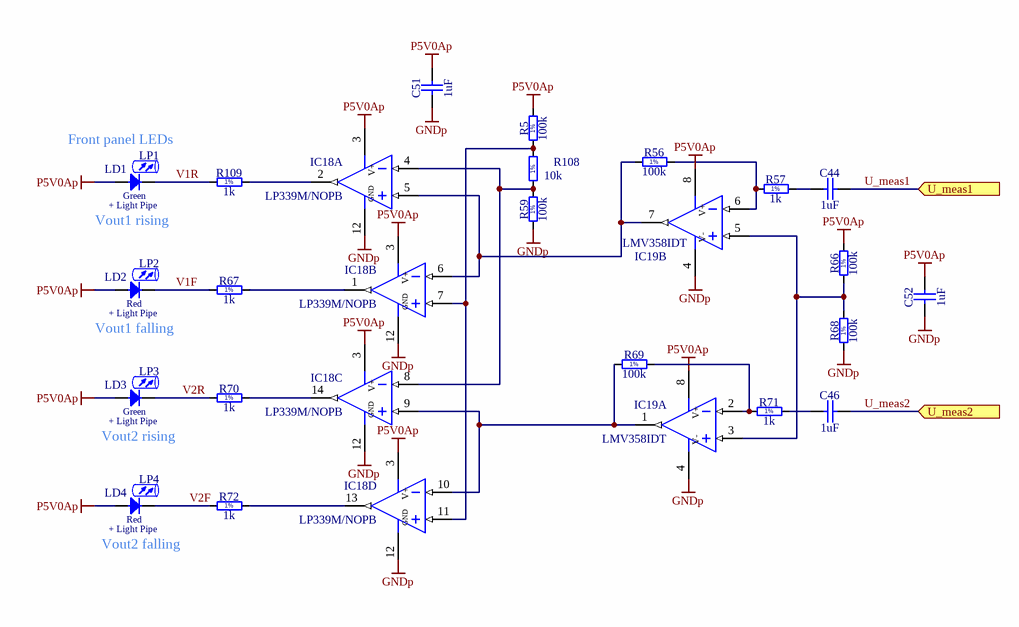
[diagram p5: LED_indicators_6W.SchDoc]

### Parts
C44  1uF  [CAPC1005X55N]
C46  1uF  [CAPC1005X55N]
C51  1uF  [CAPC1005X55N]
C52  1uF  [CAPC1005X55N]
IC18  LP339M/NOPB  [SOIC127P600X175-14N]  (parts A,B,C,D of 4)
IC19  LMV358IDT  [SOIC127P600X175-8N]  (parts A,B of 2)
LD1  Green  [LED_DIALIGHT_555-230]
LD2  Red  [LED_DIALIGHT_555-200]
LD3  Green  [LED_DIALIGHT_555-230]
LD4  Red  [LED_DIALIGHT_555-200]
LP1  (no value)  [LEDLP_BIVAR_PLP2-1200]
LP2  (no value)  [LEDLP_BIVAR_PLP2-1200]
LP3  (no value)  [LEDLP_BIVAR_PLP2-1200]
LP4  (no value)  [LEDLP_BIVAR_PLP2-1200]
R5  100k  [RESC1608X55N]
R56  100k  [RESC1608X55N]
R57  1k  [RESC1005X40N]
R59  100k  [RESC1608X55N]
R66  100k  [RESC1608X55N]
R67  1k  [RESC1005X40N]
R68  100k  [RESC1608X55N]
R69  100k  [RESC1608X55N]
R70  1k  [RESC1005X40N]
R71  1k  [RESC1005X40N]
R72  1k  [RESC1005X40N]
R108  10k  [RESC1005X40N]
R109  1k  [RESC1005X40N]

### Ports
U_meas1 (in), U_meas2 (in)

### Nets
GNDp: C51.1 C52.1 IC18.12(GND) IC19.4(V-) R59.1 R68.1
P5V0Ap: C51.2 C52.2 IC18.3(V+) IC19.8(V+) LD1.2(A) LD2.2(A) LD3.2(A) LD4.2(A) R5.2 R66.2
U_meas1: C44.2 ; port U_meas1
U_meas2: C46.2 ; port U_meas2
V1F: LD2.1(C) R67.1
V1R: LD1.1(C) R109.1
V2F: LD4.1(C) R72.1
V2R: LD3.1(C) R70.1
NetC44_1: C44.1 R57.2
NetC46_1: C46.1 R71.2
NetIC18_1: IC18.1(OUT) R67.2
NetIC18_2: IC18.2(OUT) R109.2
NetIC18_4: IC18.4(IN-) IC18.8(IN-) R59.2 R108.1
NetIC18_5: IC18.5(IN+) IC18.6(IN-) IC19.7(OUT) R56.1
NetIC18_7: IC18.7(IN+) IC18.11(IN+) R5.1 R108.2
NetIC18_9: IC18.9(IN+) IC18.10(IN-) IC19.1(OUT) R69.1
NetIC18_13: IC18.13(OUT) R72.2
NetIC18_14: IC18.14(OUT) R70.2
NetIC19_2: IC19.2(IN-) R69.2 R71.1
NetIC19_3: IC19.3(IN+) IC19.5(IN+) R66.1 R68.2
NetIC19_6: IC19.6(IN-) R56.2 R57.1

### Notes on the sheet
- Front panel LEDs
- Vout1 rising
- Vout1 falling
- Vout2 rising
- Vout2 falling
- Project/Equipment
- Document
- Designer
- Drawn by
- Check.by
- Copyright WUT ISE 2020.
  This documentation describes Open Hardware and is licensed under the CERN OHL v.1.2. You may redistribute and modify this documentation under the terms of the CERN OHL v.1.2. (http://ohwr.org/CERNOHL). This documentation is distributed WITHOUT ANY EXPRESS OR IMPLIED WARRANTY, INCLUDING OF MERCHANTABILITY, SATISFACTORY QUALITY AND FITNESS FOR A PARTICULAR PURPOSE. Please see the CERN OHL v.1.2 for applicable conditions.
- Contact
- File
- Last Mod.
- Print Date
- Sheet
- Size
- A3
- of
- Rev
- (in symbol LEDLP_BIVAR_PLP2-1200) + Light Pipe
- (in symbol R0402_1K_1%_0.0625W_100PPM) 1%
- (in symbol R0402_10K_1%_0.0625W_100PPM) 1%
- (in symbol R0603_100K_1%_0.1W_100PPM) 1%

### Library data of the parts
C44 C46 C51 C52 = CC0402_1UF_16V_10%_X5R: Non-polarised capacitor; Part Description: SMD Multilayer Chip Ceramic Capacitor; Manufacturer: GENERIC; Manufacturer1 Part Number: C1005X5R1C105KT; Voltage: 16V; TC: X5R; Tolerance: ±10%; Part Number: CC0402_1UF_16V_10%_X5R; Component Kind: Standard; Component Type: Standard; Pin Count: 2; Value: 1uF; Status: Preferred; Manufacturer Part Number: CC0402_1UF_16V_10%_X5R; Case: 0402; Mounted: Yes; Socket: No; SMD: Yes; Sense: No; Manufacturer1 Example: TDK; Manufacturer1 ComponentHeight: 0.55mm; HelpURL: \\cern.ch\dfs\Applications\Altium\Datasheets\CC0402_X5R_TDK_C.pdf; Author: CERN DEM JLC; CreateDate: 2012-10-25; LatestRevisionDate: 2012-10-25
IC18 = LP339M/NOPB: Quad Operational Amplifier; Part Description: Ultra-Low Power Quad Comparator; Manufacturer: TEXAS INSTRUMENTS; PressFit: No; Bonding: No; Part Number: LP339M/NOPB; Component Kind: Standard; Component Type: Standard; Device: LP339M/NOPB; PackageDescription: SOIC 14, Pitch 1.27mm - Body 4x8.75mm, IPC Medium Density; Manufacturer Part Number: LP339M/NOPB; Pin Count: 14; Case: SOIC14; Mounted: Yes; Socket: No; SMD: Yes; Sense: No; ComponentHeight: 1.75mm; Author: CERN DEM MR; HelpURL: \\cern.ch\dfs\Applications\Altium\Datasheets\LP339M-NOPB.pdf; CreateDate: 23.03.2016; LatestRevisionDate: 23.03.2016
IC19 = LMV358IDT: Dual Operational Amplifier; Part Description: Dual General Purpose, Low Voltage, Tiny Pack Comparator; Manufacturer: ST MICROELECTRONICS; PressFit: No; Bonding: No; Part Number: LMV358IDT; Component Kind: Standard; Component Type: Standard; Device: LMV358IDT; PackageDescription: SOIC 8, Pitch 1.27mm - Body 4x5mm, IPC Medium Density; Manufacturer Part Number: LMV358IDT; Pin Count: 8; Case: SOIC8; Mounted: Yes; Socket: No; SMD: Yes; Sense: No; ComponentHeight: 1.75mm; Author: CERN DEM HF; HelpURL: \\cern.ch\dfs\Applications\Altium\Datasheets\LMV358.pdf; CreateDate: 21.12.2023; LatestRevisionDate: 21.12.2023
LD1 LD3 = LED_DIALIGHT_555-2301F: LED Green 1C 2A; Part Description: Single 2mm Green LED CBI® Circuit Board Indicator; PressFit: No; Bonding: No; Part Number: LED_DIALIGHT_555-2301F; Component Kind: Standard; Component Type: Standard; Color: Green; PackageDescription: Single 2mm Green LED, Body 5.08x2.54mm, Pin spacing 2.54mm; Manufacturer: DIALIGHT; Manufacturer Part Number: 555-2301F; Pin Count: 2; Mounted: Yes; Socket: No; SMD: No; Sense: No; ComponentHeight: 6.35mm; HelpURL: \\cern.ch\dfs\Applications\Altium\Datasheets\LED_DIALIGHT_555-2301F.pdf; Author: CERN DEM JMW; CreateDate: 22.09.2008; LatestRevisionDate: 17.03.2010
LD2 LD4 = LED_DIALIGHT_555-2001F: LED Red 1C 2A; Part Description: Single 2mm Red LED CBI® Circuit Board Indicator; PressFit: No; Bonding: No; Part Number: LED_DIALIGHT_555-2001F; Component Kind: Standard; Component Type: Standard; Color: Red; PackageDescription: Single 2mm Red LED, Body 5.08x2.54mm, Pin spacing 2.54mm; Manufacturer: DIALIGHT; Manufacturer Part Number: 555-2001F; Pin Count: 2; Mounted: Yes; Socket: No; SMD: No; Sense: No; ComponentHeight: 6.35mm; HelpURL: \\cern.ch\dfs\Applications\Altium\Datasheets\LED_DIALIGHT_555-2001F.pdf; Author: CERN DEM JMW; CreateDate: 22.09.2008; LatestRevisionDate: 17.03.2010
LP1-LP4 = LEDLP_BIVAR_PLP2-1200: LED Light Pipe x1 Type1; Part Description: 3mm Dome Leens, Single Station Vertivcal Round Lightpipe Height 1.2 in. (30.5mm); Manufacturer: BIVAR; PressFit: No; Bonding: No; Part Number: LEDLP_BIVAR_PLP2-1200; Component Kind: Accessories; Component Type: Standard; PackageDescription: 3mm Dome Leens, Single Station Vertivcal Round Lightpipe Height 1.2 in. (30.5mm); Manufacturer Part Number: PLP2-1200; Pin Count: 0; Mounted: Yes; Socket: No; SMD: No; Sense: No; ComponentHeight: 31.3mm; HelpURL: \\cern.ch\dfs\Applications\Altium\Datasheets\LEDLP_BIVAR_PLP2-1200.pdf; Author: CERN DEM HF; CreateDate: 09.02.2022; LatestRevisionDate: 09.02.2022
R5 R56 R59 R66 R68 R69 = R0603_100K_1%_0.1W_100PPM: Resistor - 1%; Part Description: General Purpose Thick Film Chip Resistor; Manufacturer: GENERIC; Manufacturer1 Part Number: NRC06F1003TRF; Power: 0.1W; TC: ±100ppm/°C; Part Number: R0603_100K_1%_0.1W_100PPM; Component Kind: Standard; Component Type: Standard; Pin Count: 2; Value: 100k; Status: Preferred; Tolerance: ±1%; Manufacturer Part Number: R0603_100K_1%_0.1W_100PPM; Case: 0603; Mounted: Yes; Sense: No; Socket: No; SMD: Yes; Manufacturer1 Example: NIC COMPONENT; Manufacturer1 ComponentHeight: 0.55mm; HelpURL: \\cern.ch\dfs\Applications\Altium\Datasheets\R0603_NIC_NRC.pdf; Author: CERN DEM JLC; CreateDate: 2007-12-03; LatestRevisionDate: 2008-03-13
R57 R67 R70-R72 R109 = R0402_1K_1%_0.0625W_100PPM: Resistor - 1%; Part Description: General Purpose Thick Film Chip Resistor; Manufacturer: GENERIC; Manufacturer1 Part Number: 232270671002L; TC: ±100ppm/°C; Part Number: R0402_1K_1%_0.0625W_100PPM; Component Kind: Standard; Component Type: Standard; Pin Count: 2; Value: 1k; Status: Not recommended; Power: 0.0625W; Tolerance: ±1%; Manufacturer Part Number: R0402_1K_1%_0.0625W_100PPM; Case: 0402; Mounted: Yes; Sense: No; Socket: No; SMD: Yes; Manufacturer1 Example: YAGEO PHYCOMP; Manufacturer1 ComponentHeight: 0.4mm; HelpURL: \\cern.ch\dfs\Applications\Altium\Datasheets\R0402_Phycomp_RC0402.pdf; Author: CERN DEM JLC; CreateDate: 2007-12-03; LatestRevisionDate: 2012-10-17
R108 = R0402_10K_1%_0.0625W_100PPM: Resistor - 1%; Part Description: General Purpose Thick Film Chip Resistor; Manufacturer: GENERIC; Manufacturer1 Part Number: 232270671003L; TC: ±100ppm/°C; Part Number: R0402_10K_1%_0.0625W_100PPM; Component Kind: Standard; Component Type: Standard; Pin Count: 2; Value: 10k; Status: Not recommended; Power: 0.0625W; Tolerance: ±1%; Manufacturer Part Number: R0402_10K_1%_0.0625W_100PPM; Case: 0402; Mounted: Yes; Sense: No; Socket: No; SMD: Yes; Manufacturer1 Example: YAGEO PHYCOMP; Manufacturer1 ComponentHeight: 0.4mm; HelpURL: \\cern.ch\dfs\Applications\Altium\Datasheets\R0402_Phycomp_RC0402.pdf; Author: CERN DEM JLC; CreateDate: 2007-12-03; LatestRevisionDate: 2012-10-17

## Nets that join several sheets
GND: HV_Module_6W (5 pins), Isolators_HV_6W (30 pins), Supply_12V_ISOL (C4.1 L2.2)
GNDp: HV_Module_6W (5 pins), Isolators_HV_6W (23 pins), U_ADC_DAC1 (16 pins), U_HV_PWR_STAGE1 (33 pins), Supply_12V_ISOL (24 pins), U_ADC_DAC2 (16 pins), U_HV_PWR_STAGE2 (33 pins), LED_indicators_6W (6 pins)
N3V3p: U_HV_PWR_STAGE1 (6 pins), Supply_12V_ISOL (C67.2 IC2.5 IC38.5), U_HV_PWR_STAGE2 (6 pins)
P3V3: HV_Module_6W (J1.11), Isolators_HV_6W (15 pins)
P3V3Ap: U_ADC_DAC1 (C19A.2 C24A.2 IC15A.38), U_HV_PWR_STAGE1 (R175A.2), Supply_12V_ISOL (C57.2 L7.2), U_ADC_DAC2 (C19B.2 C24B.2 IC15B.38), U_HV_PWR_STAGE2 (R175B.2)
P3V3p: Isolators_HV_6W (16 pins), Supply_12V_ISOL (7 pins)
P5V0Ap: HV_Module_6W (C53.1 C54.2 IC21.2), U_HV_PWR_STAGE1 (10 pins), Supply_12V_ISOL (5 pins), U_HV_PWR_STAGE2 (10 pins), LED_indicators_6W (10 pins)
P12V0: HV_Module_6W (J1.6 J1.8 J1.10), Supply_12V_ISOL (C4.2 L2.1)
P12V0p: U_HV_PWR_STAGE1 (C70A.1 R163A.2 R164A.1 T15A.2), Supply_12V_ISOL (10 pins), U_HV_PWR_STAGE2 (C70B.1 R163B.2 R164B.1 T15B.2)
ADC_I: U_ADC_DAC1 (IC15A.30), U_HV_PWR_STAGE1 (C134A.2 R94A.1)
ADC_I: U_ADC_DAC2 (IC15B.30), U_HV_PWR_STAGE2 (C134B.2 R94B.1)
CSN: HV_Module_6W (J1.5), Isolators_HV_6W (R99.2)
CSN_ISOL: Isolators_HV_6W (IC24.8), U_ADC_DAC1 (IC15A.8)
CSN_ISOL: U_ADC_DAC1 (IC15A.14), U_ADC_DAC2 (IC15B.8)
DAC_I: U_ADC_DAC1 (IC15A.23 R27A.2), U_HV_PWR_STAGE1 (R93A.2)
DAC_I: U_ADC_DAC2 (IC15B.23 R27B.2), U_HV_PWR_STAGE2 (R93B.2)
DAC_U: U_ADC_DAC1 (IC15A.24 R25A.2), U_HV_PWR_STAGE1 (R78A.2)
DAC_U: U_ADC_DAC2 (IC15B.24 R25B.2), U_HV_PWR_STAGE2 (R78B.2)
ENBL: Isolators_HV_6W (IC27.2), U_HV_PWR_STAGE1 (IC11A.2 R172A.2), U_HV_PWR_STAGE2 (IC11B.2 R172B.2)
ENBLn1: U_ADC_DAC1 (IC15A.1), U_HV_PWR_STAGE1 (IC11A.1 R175A.1)
ENBLn2: U_ADC_DAC2 (IC15B.1), U_HV_PWR_STAGE2 (IC11B.1 R175B.1)
EXT_SCKI_ISOL: U_ADC_DAC1 (IC15A.13), U_ADC_DAC2 (IC15B.6)
EXT_SDI_ISOL: U_ADC_DAC1 (IC15A.12), U_ADC_DAC2 (IC15B.7)
EXT_SDO_ISOL: U_ADC_DAC1 (IC15A.11), U_ADC_DAC2 (IC15B.5)
HV_EN: HV_Module_6W (J1.15), Isolators_HV_6W (IC28.1)
HV_OUT: HV_Module_6W (J7.1), U_HV_PWR_STAGE1 (R76A.2 R170A.2)
HV_OUT: HV_Module_6W (J4.1), U_HV_PWR_STAGE2 (R76B.2 R170B.2)
INT0: HV_Module_6W (J1.9), Isolators_HV_6W (IC28.4)
INT0_ISOLn: Isolators_HV_6W (IC27.3 R107.1), U_ADC_DAC1 (T12A.3), U_ADC_DAC2 (T12B.3)
REFIN: HV_Module_6W (C55.2 IC21.6), U_ADC_DAC1 (R20A.2 R22A.2), U_ADC_DAC2 (R20B.2 R22B.2)
SCKI: HV_Module_6W (J1.7), Isolators_HV_6W (R95.2)
SCKI_ISOL: Isolators_HV_6W (IC23.8), U_ADC_DAC1 (IC15A.6)
SDI: HV_Module_6W (J1.1), Isolators_HV_6W (R2.2)
SDI_ISOL: Isolators_HV_6W (IC1.8), U_ADC_DAC1 (IC15A.7)
SDO: HV_Module_6W (J1.3), Isolators_HV_6W (IC25.8)
SDO_ISOL: Isolators_HV_6W (R103.2), U_ADC_DAC1 (IC15A.5)
U_meas1: U_ADC_DAC1 (IC15A.31), U_HV_PWR_STAGE1 (C128A.2 R80A.1), LED_indicators_6W (C44.2)
U_meas2: U_ADC_DAC2 (IC15B.31), U_HV_PWR_STAGE2 (C128B.2 R80B.1), LED_indicators_6W (C46.2)

## Assembly variants
HV_POS: not fitted C132B D1A D1B D2A D2B D25A D25B D26A D26B D27A D27B D28A D28B D29A D29B D30A D30B R50A R63A R63B R89A R89B
HV_NEG: not fitted C132A C132B D12A D12B D13A D13B D19A D19B D20A D20B D21A D21B D22A D22B D23A D23B D24A D24B R74A R74B R119A R119B
HV_POS_NEG: not fitted C82A C82B D1A D2A D12B D13B D19B D20B D21B D22B D23B D24B D25A D26A D27A D28A D29A D30A R63A R74B R89A R119B